# Altium schematic sheet SAM9X60_IO.SchDoc
size A; DocumentNumber: 3; SheetNumber: 3; SheetTotal: 6
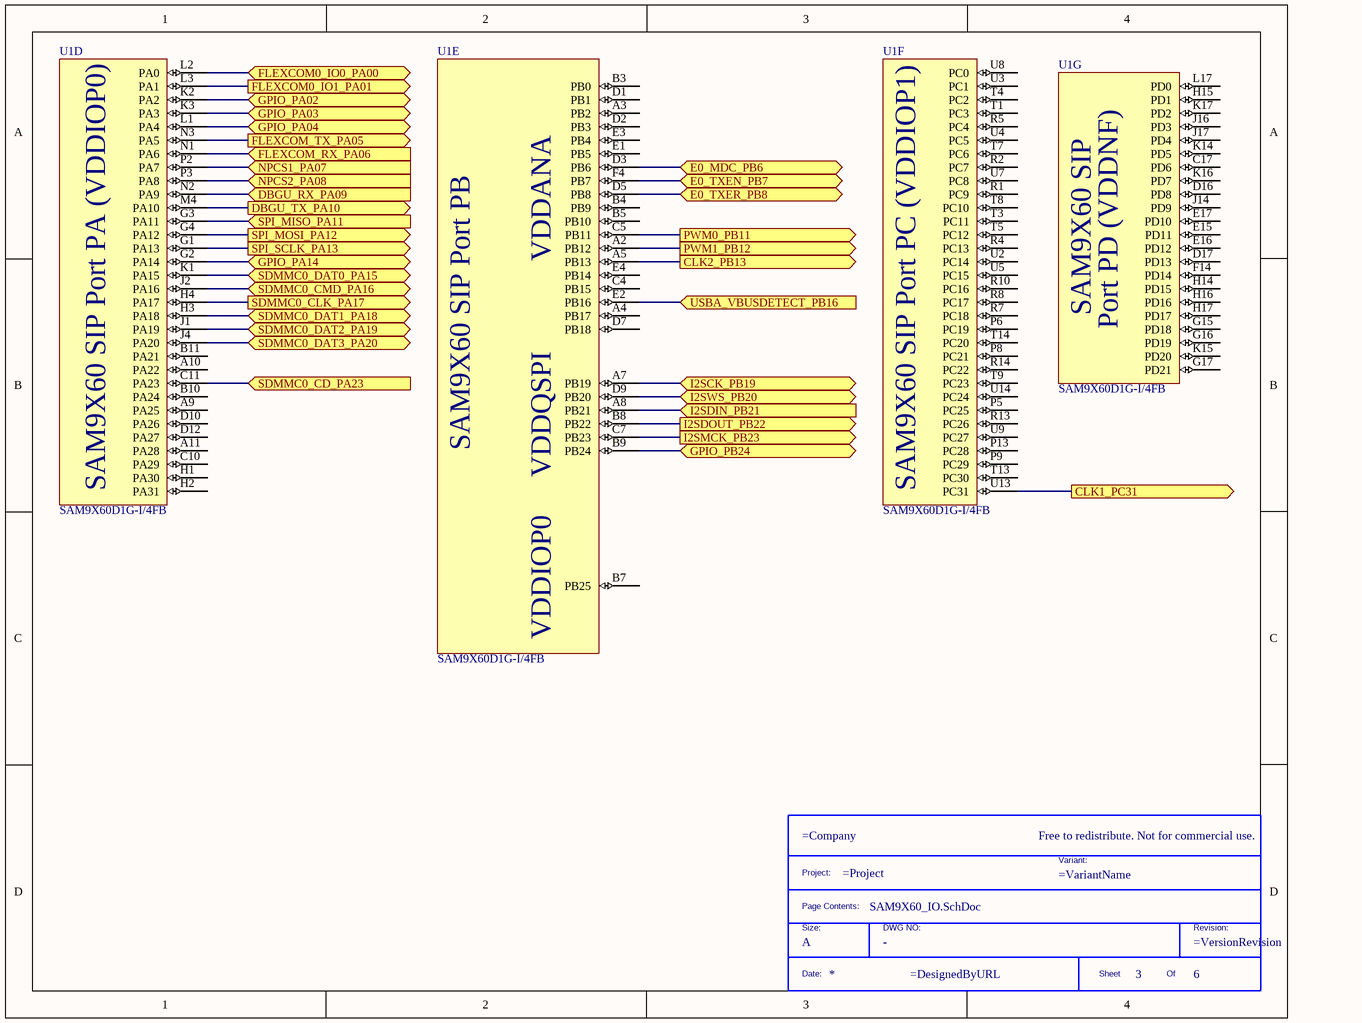
[diagram p0: SAM9X60_IO.SchDoc]

## Parts
*  Size: A  (hidden comment: TitleBlock)  (graphical)
U1  SAM9X60D1G-I/4FB  [BGA233C80P17X17_1400X1400X120]  (parts D,E,F,G of 7)

## Ports
CLK1_PC31 (out), CLK2_PB13 (out), DBGU_RX_PA09 (in), DBGU_TX_PA10 (out), E0_MDC_PB6 (bidir), E0_TXEN_PB7 (bidir), E0_TXER_PB8 (bidir), FLEXCOM0_IO0_PA00 (bidir), FLEXCOM0_IO1_PA01 (out), FLEXCOM_RX_PA06 (in), FLEXCOM_TX_PA05 (out), GPIO_PA02 (bidir), GPIO_PA03 (bidir), GPIO_PA04 (bidir), GPIO_PA14 (bidir), GPIO_PB24 (bidir), I2SCK_PB19 (bidir), I2SDIN_PB21 (in), I2SDOUT_PB22 (out), I2SMCK_PB23 (out), I2SWS_PB20 (bidir), NPCS1_PA07 (in), NPCS2_PA08 (in), PWM0_PB11 (out), PWM1_PB12 (out), SDMMC0_CD_PA23 (in), SDMMC0_CLK_PA17 (out), SDMMC0_CMD_PA16 (bidir), SDMMC0_DAT0_PA15 (bidir), SDMMC0_DAT1_PA18 (bidir), SDMMC0_DAT2_PA19 (bidir), SDMMC0_DAT3_PA20 (bidir), SPI_MISO_PA11 (in), SPI_MOSI_PA12 (out), SPI_SCLK_PA13 (out), USBA_VBUSDETECT_PB16 (in)

## Nets
CLK1_PC31: U1.U13(PC31) ; port CLK1_PC31
CLK2_PB13: U1.A5(PB13) ; port CLK2_PB13
DBGU_RX_PA09: U1.N2(PA9) ; port DBGU_RX_PA09
DBGU_TX_PA10: U1.M4(PA10) ; port DBGU_TX_PA10
E0_MDC_PB6: U1.D3(PB6) ; port E0_MDC_PB6
E0_TXEN_PB7: U1.F4(PB7) ; port E0_TXEN_PB7
E0_TXER_PB8: U1.D5(PB8) ; port E0_TXER_PB8
FLEXCOM0_IO0_PA00: U1.L2(PA0) ; port FLEXCOM0_IO0_PA00
FLEXCOM0_IO1_PA01: U1.L3(PA1) ; port FLEXCOM0_IO1_PA01
FLEXCOM_RX_PA06: U1.N1(PA6) ; port FLEXCOM_RX_PA06
FLEXCOM_TX_PA05: U1.N3(PA5) ; port FLEXCOM_TX_PA05
GPIO_PA02: U1.K2(PA2) ; port GPIO_PA02
GPIO_PA03: U1.K3(PA3) ; port GPIO_PA03
GPIO_PA04: U1.L1(PA4) ; port GPIO_PA04
GPIO_PA14: U1.G2(PA14) ; port GPIO_PA14
GPIO_PB24: U1.B9(PB24) ; port GPIO_PB24
I2SCK_PB19: U1.A7(PB19) ; port I2SCK_PB19
I2SDIN_PB21: U1.A8(PB21) ; port I2SDIN_PB21
I2SDOUT_PB22: U1.B8(PB22) ; port I2SDOUT_PB22
I2SMCK_PB23: U1.C7(PB23) ; port I2SMCK_PB23
I2SWS_PB20: U1.D9(PB20) ; port I2SWS_PB20
NPCS1_PA07: U1.P2(PA7) ; port NPCS1_PA07
NPCS2_PA08: U1.P3(PA8) ; port NPCS2_PA08
PWM0_PB11: U1.C5(PB11) ; port PWM0_PB11
PWM1_PB12: U1.A2(PB12) ; port PWM1_PB12
SDMMC0_CD_PA23: U1.C11(PA23) ; port SDMMC0_CD_PA23
SDMMC0_CLK_PA17: U1.H4(PA17) ; port SDMMC0_CLK_PA17
SDMMC0_CMD_PA16: U1.J2(PA16) ; port SDMMC0_CMD_PA16
SDMMC0_DAT0_PA15: U1.K1(PA15) ; port SDMMC0_DAT0_PA15
SDMMC0_DAT1_PA18: U1.H3(PA18) ; port SDMMC0_DAT1_PA18
SDMMC0_DAT2_PA19: U1.J1(PA19) ; port SDMMC0_DAT2_PA19
SDMMC0_DAT3_PA20: U1.J4(PA20) ; port SDMMC0_DAT3_PA20
SPI_MISO_PA11: U1.G3(PA11) ; port SPI_MISO_PA11
SPI_MOSI_PA12: U1.G4(PA12) ; port SPI_MOSI_PA12
SPI_SCLK_PA13: U1.G1(PA13) ; port SPI_SCLK_PA13
USBA_VBUSDETECT_PB16: U1.E2(PB16) ; port USBA_VBUSDETECT_PB16

Not connected (* = marked no-connect by the designer): U1 A3(PB2) A4(PB17) A9(PA25) A10(PA22) A11(PA28) B3(PB0) B4(PB9) B5(PB10) B7(PB25) B10(PA24) B11(PA21) C4(PB15) C10(PA29) C17(PD6) D1(PB1) D2(PB3) D7(PB18) D10(PA26) D12(PA27) D16(PD8) D17(PD13) E1(PB5) E3(PB4) E4(PB14) E15(PD11) E16(PD12) E17(PD10) F14(PD14) G15(PD18) G16(PD19) G17(PD21) H1(PA30) H2(PA31) H14(PD15) H15(PD1) H16(PD16) H17(PD17) J14(PD9) J16(PD3) J17(PD4) K14(PD5) K15(PD20) K16(PD7) K17(PD2) L17(PD0) P5(PC25) P6(PC19) P8(PC21) P9(PC29) P13(PC28) R1(PC9) R2(PC7) R4(PC13) R5(PC4) R7(PC18) R8(PC17) R10(PC16) R13(PC26) R14(PC22) T1(PC3) T3(PC11) T4(PC2) T5(PC12) T7(PC6) T8(PC10) T9(PC23) T13(PC30) T14(PC20) U2(PC14) U3(PC1) U4(PC5) U5(PC15) U7(PC8) U8(PC0) U9(PC27) U14(PC24)

## Notes on the sheet
- (in symbol SAM9X60D1G-I/4FB, part D) SAM9X60 SIP Port PA (VDDIOP0)
- (in symbol SAM9X60D1G-I/4FB, part E) SAM9X60 SIP Port PB
- (in symbol SAM9X60D1G-I/4FB, part F) SAM9X60 SIP Port PC (VDDIOP1)
- (in symbol SAM9X60D1G-I/4FB, part G) SAM9X60 SIP; Port PD (VDDNF)
- (in symbol TitleBlock) Free to redistribute. Not for commercial use.; Project:; Variant:; Page Contents:; Size:; DWG NO:; Revision:; Date:; Sheet; Of

## Library data of the parts
* = TitleBlock: Custom Title Block; DWG: -
U1 = SAM9X60D1G-I/4FB: ARM926 MPU, 1GBIT DDR2, BGA, IND TEMP; Manufacturer: Microchip; Manufacturer Part Number: SAM9X60D6K-I/4GB; Supplier 1: Digi-Key; RoHS: No; Category: Microprocessors; Stock 1: 237; Pricing 1: 1=10.63000, 25=9.74040, 100=8.82060 (USD); Supplier Part Number 1: 150-SAM9X60D6K-I/4GB-ND